# Altium project shkabara_motherboard.PrjPcb
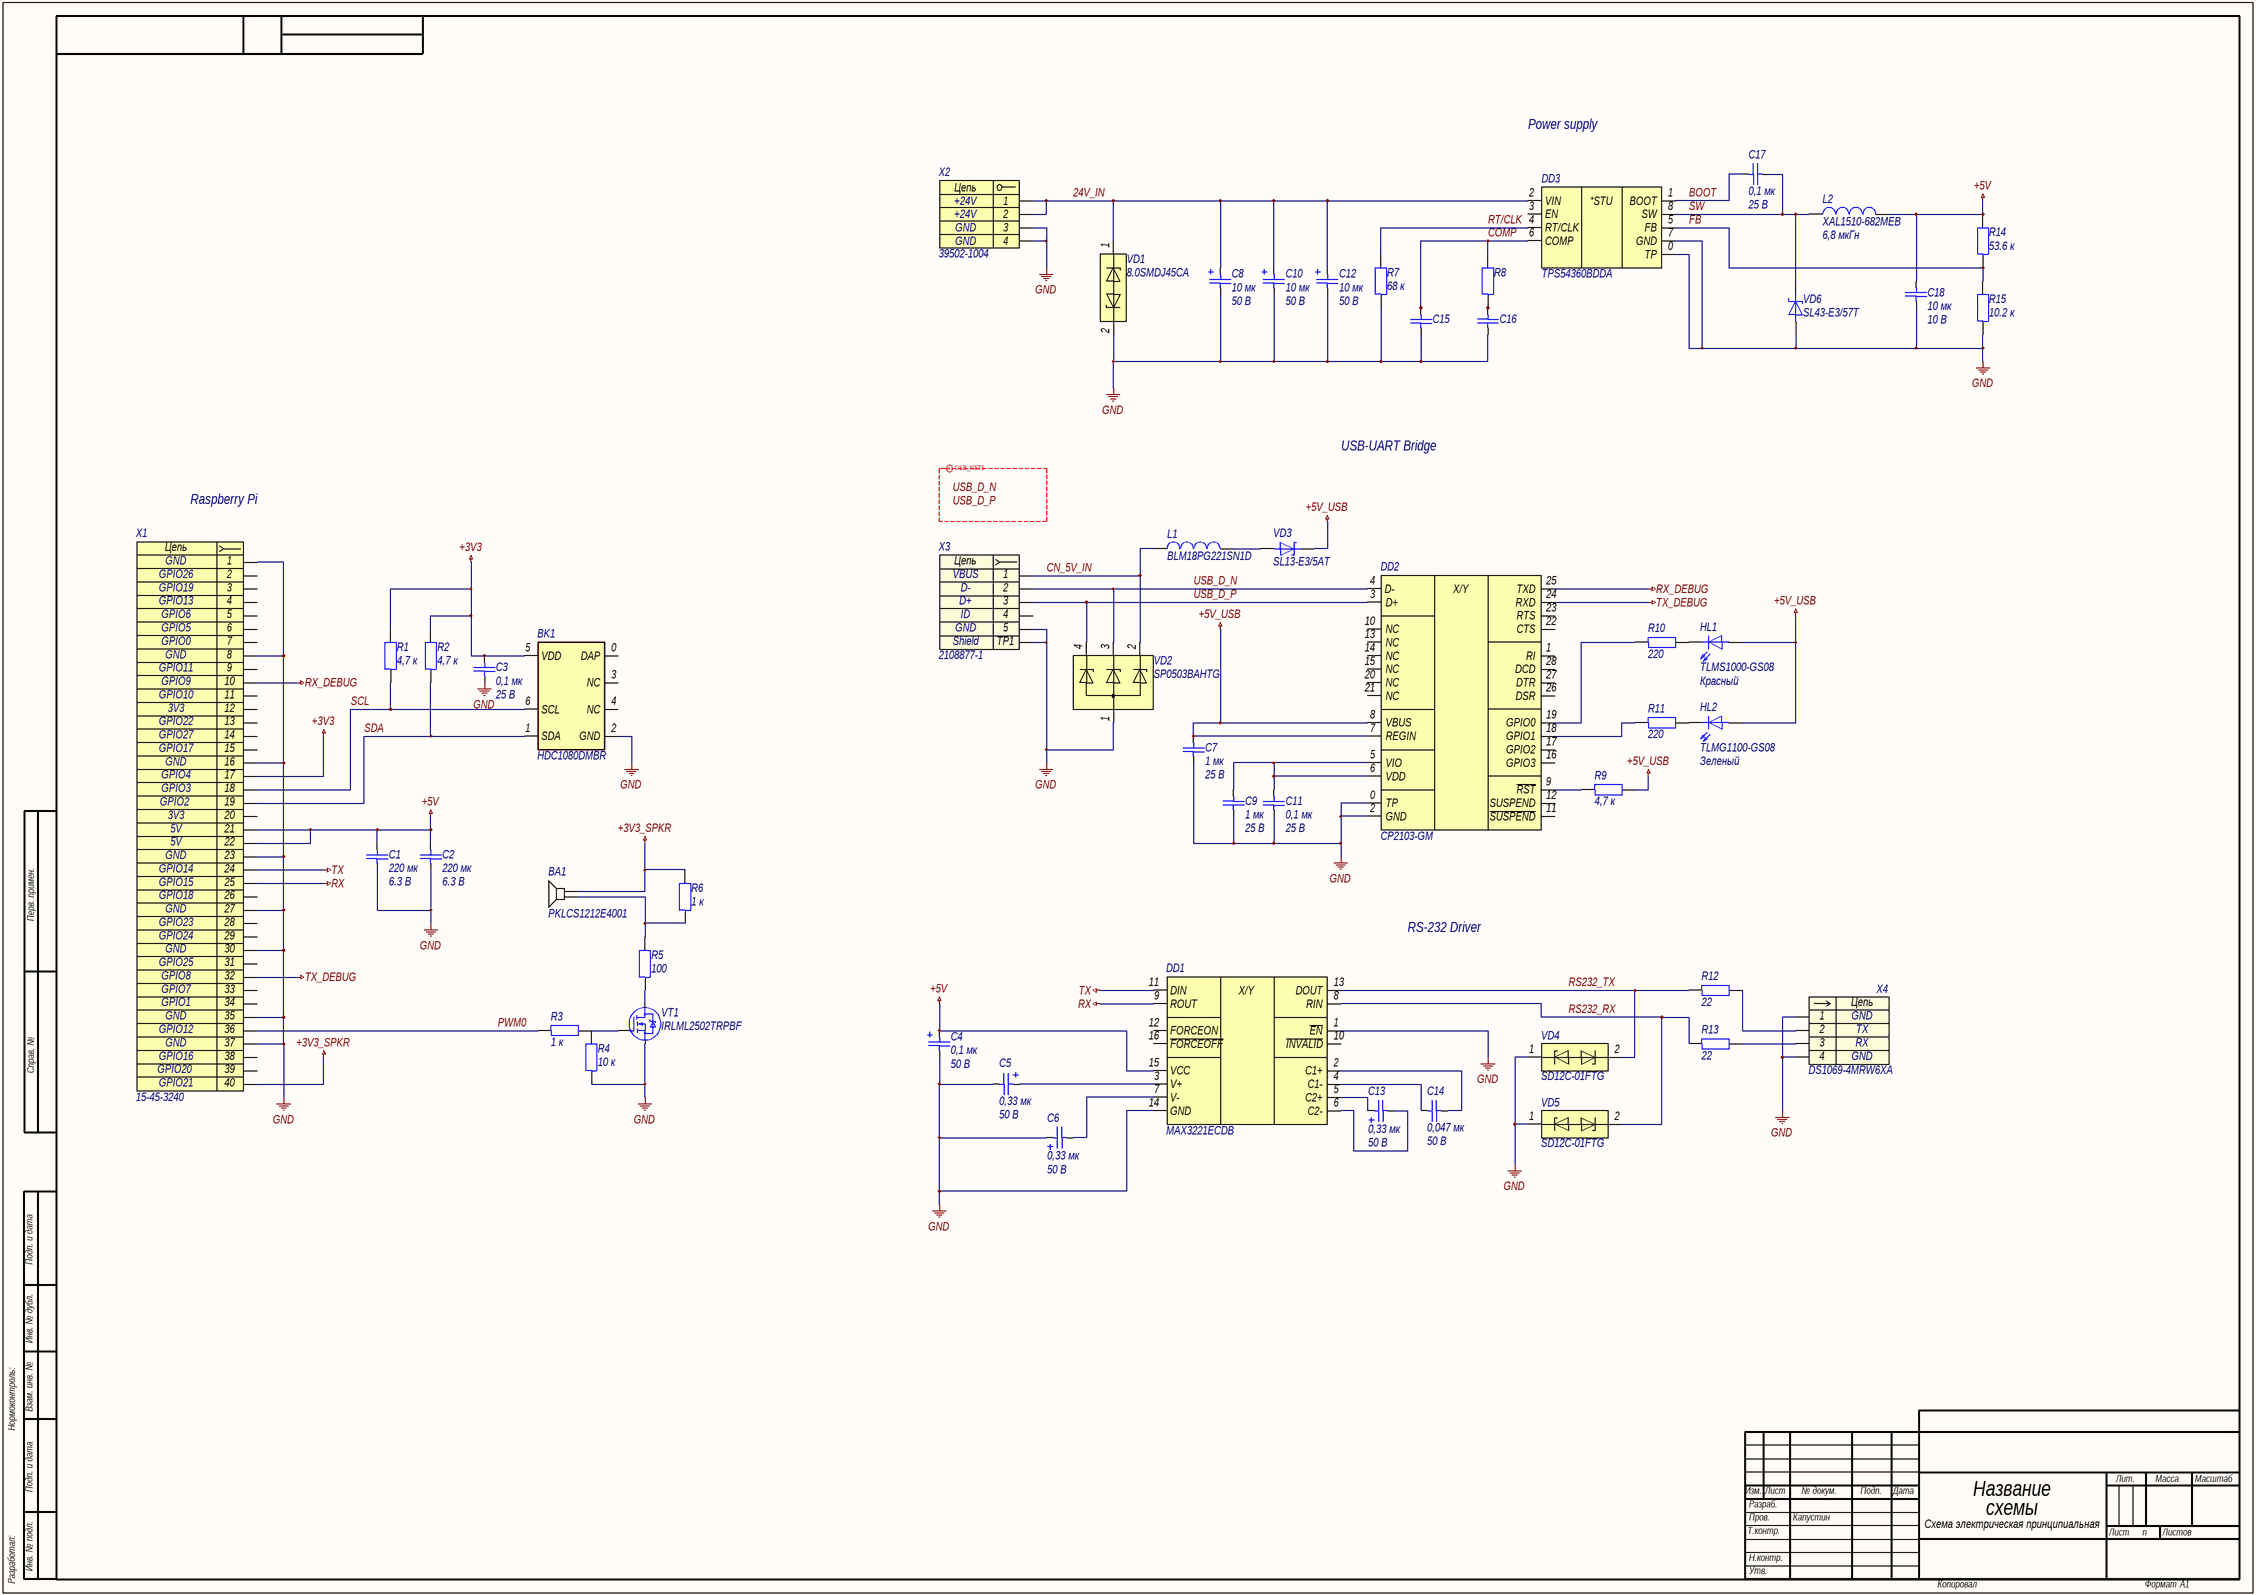
[diagram p0: shkabara_motherboard.SchDoc]
approver: Капустин; check: Капустин; designation: СПБПУ.3331506.026; developer: Шкабара; document_code: Ý3; document_type: Схема электрическая принципиальная; pcb_dec_number: СПБПУ.3331506.026; project: Введите название проекта; sheets_total: 1; title: Введите полное название схемы; title_line_1: Название; title_line_2: схемы
1 sheet, 53 parts. Net scope: global (net labels, ports and power ports of the same name join across sheets).
Board file: shkabara_motherboard.PcbDoc

## Sheet shkabara_motherboard.SchDoc: Введите полное название схемы
size 840 x 594 mm; ApprovedBy: Капустин; CheckedBy: Капустин; DrawnBy: Шкабара; DocumentNumber: СПБПУ.3331506.026Ý3; SheetNumber: n; SheetTotal: 1; DocumentCode: Ý3; ImagePath: СПБПУ.3331506.026

### Parts
BA1  PKLCS1212E4001  [PKLCS1212E4001]
BK1  HDC1080DMBR  [PSON100P300X80_HS-7N]
C1  220 мк  Напряжение: 6.3 В  [C1210]
C2  220 мк  Напряжение: 6.3 В  [C1210]
C3  0,1 мк  Напряжение: 25 В  [C0402]
C4  0,1 мк  Напряжение: 50 В  [C3216-18]
C5  0,33 мк  Напряжение: 50 В  [C3528-21]
C6  0,33 мк  Напряжение: 50 В  [C3528-21]
C7  1 мк  Напряжение: 25 В  [C0603]
C8  10 мк  Напряжение: 50 В  [C7343-43]
C9  1 мк  Напряжение: 25 В  [C0603]
C10  10 мк  Напряжение: 50 В  [C7343-43]
C11  0,1 мк  Напряжение: 25 В  [C0603]
C12  10 мк  Напряжение: 50 В  [C7343-43]
C13  0,33 мк  Напряжение: 50 В  [C3528-21]
C14  0,047 мк  Напряжение: 50 В  [C0603]
C15  1000  [C0603]  (value not drawn)
C16  0,01 мк  [C0603]  (value not drawn)
C17  0,1 мк  Напряжение: 25 В  [C0402]
C18  10 мк  Напряжение: 10 В  [C0805]
DD1  MAX3221ECDB  [SSOP-16-P65-620X530X200-L75X30]
DD2  CP2103-GM  [QFN-28-P50-500X500X100-L55X25-T315X315]
DD3  TPS54360BDDA  [HSOIC-8-P127-490X390X170-L84X41-T310X240]
HL1  TLMS1000-GS08  Цвет: Красный  [HL0603]
HL2  TLMG1100-GS08  Цвет: Зеленый  [HL0603]
L1  BLM18PG221SN1D  [BLM-2-0603]
L2  XAL1510-682MEB  Индуктивность: 6,8 мкГн  [XAL-2-1620X1520X1000]
R1  4,7 к  [R0603]
R2  4,7 к  [R0603]
R3  1 к  [R0603]
R4  10 к  [R0603]
R5  100  [R0603]
R6  1 к  [R0603]
R7  68 к  [R0603]
R8  3,3 к  [R0603]  (value not drawn)
R9  4,7 к  [R0603]
R10  220  [R0603]
R11  220  [R0603]
R12  22  [R0603]
R13  22  [R0603]
R14  53.6 к  [R1218]
R15  10.2 к  [R1218]
VD1  8.0SMDJ45CA  [DO-214AB-790X590X262]
VD2  SP0503BAHTG  [SOT-143-4-P190-292X237X122]
VD3  SL13-E3/5AT  [DO-214AC-510X270X229]
VD4  SD12C-01FTG  [SOD-323-257X130X114]
VD5  SD12C-01FTG  [SOD-323-257X130X114]
VD6  SL43-E3/57T  [DO-214AB-790X590X262]
VT1  IRLML2502TRPBF  [SOT-23-3-P95-292X237X112]
X1  15-45-3240  [15-45-3240]
X2  39502-1004  [39502-1004]
X3  2108877-1  [2108877-1]
X4  DS1069-4MRW6XA  [DS1069-4MRW6XA]

### Nets
+3V3: BK1.5(VDD) C3.1 R1.2 R2.2 X1.17
+3V3_SPKR: BA1.2 R6.2 X1.40
+5V: C1.1 C2.1 C4.1 C18.1 DD1.15(VCC) L2.2 R14.2 X1.21 X1.22
+5V_USB: C7.1 DD2.7(REGIN) DD2.8(VBUS) HL1.2 HL2.2 R9.2 VD3.1
GND: BK1.2(GND) C1.2 C2.2 C3.2 C4.2 C5.2 C6.1 C7.2 C8.2 C9.1 C10.2 C11.2 C12.2 C15.2 C16.1 C18.2 DD1.1(~{EN}) DD1.14(GND) DD2.0(TP) DD2.2(GND) DD3.0(TP) DD3.7(GND) R4.1 R7.1 R15.1 VD1.2 VD2.1 VD4.1 VD5.1 VD6.2 VT1.S X1.1 X1.8 X1.16 X1.23 X1.27 X1.30 X1.35 X1.37 X2.3 X2.4 X3.5 X3.TP1 X4.1 X4.4
RX: DD1.9(ROUT) X1.25
RX_DEBUG: DD2.25(TXD) X1.10
TX: DD1.11(DIN) X1.24
TX_DEBUG: DD2.24(RXD) X1.32
24V_IN: C8.1 C10.1 C12.1 DD3.2(VIN) VD1.1 X2.1 X2.2
BOOT: C17.2 DD3.1(BOOT)
CN_5V_IN: L1.1 VD2.2 X3.1
COMP: C15.1 DD3.6(COMP) R8.2
FB: DD3.5(FB) R14.1 R15.2
PWM0: R3.1 X1.36
RS232_RX: DD1.8(RIN) R13.1 VD5.2
RS232_TX: DD1.13(DOUT) R12.1 VD4.2
RT/CLK: DD3.4(RT/CLK) R7.2
SCL: BK1.6(SCL) R1.1 X1.18
SDA: BK1.1(SDA) R2.1 X1.19
SW: C17.1 DD3.8(SW) L2.1 VD6.1
USB_D_N: DD2.4(D-) VD2.3 X3.2
USB_D_P: DD2.3(D+) VD2.4 X3.3
NetBA1_1: BA1.1 R5.2 R6.1
NetC5_1: C5.1 DD1.3(V+)
NetC6_2: C6.2 DD1.7(V-)
NetC9_2: C9.2 C11.1 DD2.5(VIO) DD2.6(VDD)
NetC13_1: C13.1 DD1.5(C2+)
NetC13_2: C13.2 DD1.6(C2-)
NetC14_1: C14.1 DD1.4(C1-)
NetC14_2: C14.2 DD1.2(C1+)
NetC16_2: C16.2 R8.1
NetDD2_9: DD2.9(~{RST}) R9.1
NetDD2_18: DD2.18(GPIO1) R11.1
NetDD2_19: DD2.19(GPIO0) R10.1
NetHL1_1: HL1.1 R10.2
NetHL2_1: HL2.1 R11.2
NetL1_2: L1.2 VD3.2
NetR3_2: R3.2 R4.2 VT1.G
NetR5_1: R5.1 VT1.D
NetR12_2: R12.2 X4.2
NetR13_2: R13.2 X4.3

Not connected (* = marked no-connect by the designer): BK1 0(DAP) 3(NC) 4(NC); DD1 10(~{INVALID}) 12(FORCEON) 16(~{FORCEOFF}); DD2 1(RI) 10(NC) 11(~{SUSPEND}) 12(SUSPEND) 13(NC) 14(NC) 15(NC) 16(GPIO3) 17(GPIO2) 20(NC) 21(NC) 22(CTS) 23(RTS) 26(DSR) 27(DTR) 28(DCD); DD3 3(EN); X1 2 3 4 5 6 7 9 11 12 13 14 15 20 26 28 29 31 33 34 38 39; X3 4

### Layout directives
differential pair; rule Differential Pairs Routing [Pref Gap = 0.254mm    Min Gap  = 0.15mm    Max Gap  = 0.254mmPref Width = 0.381mm    Min Width  = 0.155mm    Max Width  = 0.381mm]; differential pair class USB_SIGNALS: USB_D_N, USB_D_P

### Notes on the sheet
- Power supply
- USB-UART Bridge
- Raspberry Pi
- RS-232 Driver
- Labels drawn without touching a wire or pin: USB_D_N, USB_D_P
- Перв. примен.
- Справ. №
- Подп. и дата
- Инв. № дубл.
- Нормоконтроль:
- Взам. инв. №
- Изм.
- Лист
- № докум.
- Подп.
- Дата
- Лит.
- Масса
- Масштаб
- Т.контр.
- Пров.
- Разраб.
- Листов
- Разработал:
- Инв. № подл.
- Н.контр.
- Утв.
- Копировал
- Формат
- А1
- (in symbol dd0004) X/Y
- (in symbol dd0006) *STU
- (in symbol dd0015) X/Y
- (in symbol x0001) Цепь
- (in symbol x0043) Цепь
- (in symbol x0049) Цепь
- (in symbol x0054) Цепь

### Library data of the parts
BA1 = PKLCS1212E4001: Piezoelectric Sounders External Drive SMD Type; URL: http://www.farnell.com/datasheets/2157985.pdf
BK1 = HDC1080: HDC1080 Low Power, High Accuracy Digital Humidity Sensor with Temperature Sensor; URL: https://www.ti.com/lit/ds/symlink/hdc1080.pdf?ts=1618660538685
C1 C2 = c0158: =Описание; ID: c0158; Фамилия: Шкабара; Описание: Конденсатор керамический чип 1210 220 мкФ 6.3 В ±10 %; Наименование: CC1210KRX5R5BB227; Производитель: YAGEO Corp.; Отклонение: ±10 %; Рабочие температуры: от –55 °С до +85 °С; Температурный коэффициент емкости: X5R; Корпус: 1210; Номинал: 220 мк; Номинальное напряжение: 6.3 В; HelpURL: https://www.yageo.com/upload/media/product/productsearch/datasheet/mlcc/UPY-GPHC_X5R_4V-to-50V_26.pdf
C3 C17 = c0062: =Описание; ID: c0062; Фамилия: Паньков; Описание: Конденсатор керамический чип 0402 100 нФ 25 В ±10 %; Наименование: CC0402KRX5R8BB104; Производитель: YAGEO Corp.; Отклонение: ±10 %; Рабочие температуры: от –55 °С до +85 °С; Температурный коэффициент емкости: X5R; Корпус: 0402; Номинал: 0,1 мк; Номинальное напряжение: 25 В; HelpURL: https://www.yageo.com/upload/media/product/productsearch/datasheet/mlcc/UPY-GPHC_X5R_4V-to-50V_26.pdf
C4 = c0001: =Описание; ID: c0001; Фамилия: Ларионов; Описание: Конденсатор танталовый чип 3216-18 100 нФ 50 В ±10 %; Наименование: 293D104X9050A2TE3; Производитель: Vishay Intertechnology, Inc.; Отклонение: ±10 %; Эквивалентное последовательное сопротивление: 19,0 Ом; Среднеквадратичный размах пульсации тока: 0,06 А; Рабочие температуры: от –55 °С до +125 °С; Корпус: 3216-18; Номинал: 0,1 мк; Номинальное напряжение: 50 В; HelpURL: https://www.vishay.com/capacitors/list/product-40002/
C5 C6 C13 = c0005: =Описание; ID: c0005; Фамилия: Паньков; Описание: Конденсатор танталовый чип 3528-21 330 нФ 50 В ±10 %; Наименование: 293D334X9050B2TE3; Производитель: Vishay Intertechnology, Inc.; Отклонение: ±10 %; Эквивалентное последовательное сопротивление: 10,0 Ом; Среднеквадратичный размах пульсации тока: 0,09 А; Рабочие температуры: от –55 °С до +125 °С; Корпус: 3528-21; Номинал: 0,33 мк; Номинальное напряжение: 50 В; HelpURL: https://www.vishay.com/capacitors/list/product-40002/
C7 C9 = c0095: =Описание; ID: c0095; Фамилия: Ларионов; Описание: Конденсатор керамический чип 0603 1 мкФ 25 В ±10 %; Наименование: CC0603KRX7R8BB105; Производитель: YAGEO Corp.; Отклонение: ±10 %; Рабочие температуры: от –55 °С до +125 °С; Температурный коэффициент емкости: X7R; Корпус: 0603; Номинал: 1 мк; Номинальное напряжение: 25 В; HelpURL: https://www.yageo.com/upload/media/product/productsearch/datasheet/mlcc/UPY-GPHC_X7R_6.3V-to-50V_20.pdf
C8 C10 C12 = c0082: =Описание; ID: c0082; Фамилия: Паньков; Описание: Конденсатор танталовый чип 7343-43 10 мкФ 50 В ±10 %; Наименование: 293D106X9050E2TE3; Производитель: Vishay Intertechnology, Inc.; Отклонение: ±10 %; Эквивалентное последовательное сопротивление: 0,8 Ом; Среднеквадратичный размах пульсации тока: 0,45 А; Рабочие температуры: от –55 °С до +125 °С; Корпус: 7343-43; Номинал: 10 мк; Номинальное напряжение: 50 В; HelpURL: https://www.vishay.com/capacitors/list/product-40002/
C11 = c0063: =Описание; ID: c0063; Фамилия: Паньков; Описание: Конденсатор керамический чип 0603 100 нФ 25 В ±10 %; Наименование: CC0603KRX7R8BB104; Производитель: YAGEO Corp.; Отклонение: ±10 %; Рабочие температуры: от –55 °С до +125 °С; Температурный коэффициент емкости: X7R; Корпус: 0603; Номинал: 0,1 мк; Номинальное напряжение: 25 В; HelpURL: https://www.yageo.com/upload/media/product/productsearch/datasheet/mlcc/UPY-GPHC_X7R_6.3V-to-50V_20.pdf
C14 = c0055: =Описание; ID: c0055; Фамилия: Паньков; Описание: Конденсатор керамический чип 0603 47 нФ 50 В ±10 %; Наименование: CC0603KRX7R9BB473; Производитель: YAGEO Corp.; Отклонение: ±10 %; Рабочие температуры: от –55 °С до +125 °С; Температурный коэффициент емкости: X7R; Корпус: 0603; Номинал: 0,047 мк; Номинальное напряжение: 50 В; HelpURL: https://www.yageo.com/upload/media/product/productsearch/datasheet/mlcc/UPY-GPHC_X7R_6.3V-to-50V_20.pdf
C15 = c0020: =Описание; Напряжение: 50 В; ID: c0020; Фамилия: Паньков; Описание: Конденсатор керамический чип 0603 1 нФ 50 В ±10 %; Наименование: CC0603KRX7R9BB102; Производитель: YAGEO Corp.; Отклонение: ±10 %; Рабочие температуры: от –55 °С до +125 °С; Температурный коэффициент емкости: X7R; Корпус: 0603; Номинал: 1000; Номинальное напряжение: 50 В; HelpURL: https://www.yageo.com/upload/media/product/productsearch/datasheet/mlcc/UPY-GPHC_X7R_6.3V-to-50V_20.pdf
C16 = c0040: =Описание; Напряжение: 50 В; ID: c0040; Фамилия: Паньков; Описание: Конденсатор керамический чип 0603 10 нФ 50 В ±10 %; Наименование: CC0603KRX7R9BB103; Производитель: YAGEO Corp.; Отклонение: ±10 %; Рабочие температуры: от –55 °С до +125 °С; Температурный коэффициент емкости: X7R; Корпус: 0603; Номинал: 0,01 мк; Номинальное напряжение: 50 В; HelpURL: https://www.yageo.com/upload/media/product/productsearch/datasheet/mlcc/UPY-GPHC_X7R_6.3V-to-50V_20.pdf
C18 = c0124: =Описание; ID: c0124; Фамилия: Паньков; Описание: Конденсатор керамический чип 0805 10 мкФ 10 В ±10 %; Наименование: CC0805KKX7R6BB106; Производитель: YAGEO Corp.; Отклонение: ±10 %; Рабочие температуры: от –55 °С до +125 °С; Температурный коэффициент емкости: X7R; Корпус: 0805; Номинал: 10 мк; Номинальное напряжение: 10 В; HelpURL: https://www.yageo.com/upload/media/product/productsearch/datasheet/mlcc/UPY-GPHC_X7R_6.3V-to-50V_20.pdf
DD1 = dd0015: =Описание; ID: dd0015; Фамилия: Шкабара; Описание: Приемопередатчик RS-232; Производитель: Texas Instruments Inc.; Рабочие температуры: от 0 до +70 °C; Корпус: SSOP-16; Наименование: MAX3221ECDB; HelpURL: https://www.ti.com/product/MAX3221E
DD2 = dd0004: =Описание; ID: dd0004; Фамилия: Кондрашова; Описание: Преобразователь USB-UART; Производитель: Silicon Laboratories; Рабочие температуры: от –40 до +85 °C; Корпус: QFN-28; Наименование: CP2103-GM; HelpURL: https://www.silabs.com/interface/usb-bridges/classic/device.cp2103
DD3 = dd0006: =Описание; ID: dd0006; Фамилия: Жернаков; Описание: Понижающий преобразователь напряжения 4,5…60 В / 1…58,8 В и 3,5 А; Производитель: Texas Instruments Inc.; Входное напряжение: от 4,5 В до 60 В; Выходное напряжение: от 1,0 В до 58,8 В; Коммутируемый ток: до 3,5 А; Частота переключения: от 100 кГц до 2,5 МГц; Рабочие температуры: от –40 °С до +150 °С; Корпус: HSOIC-8; Наименование: TPS54360BDDA; HelpURL: https://www.ti.com/product/TPS54360B
HL1 = hl0001: =Описание; ID: hl0001; Фамилия: Ларионов; Описание: Светодиод чип 0603 красный; Производитель: Vishay Intertechnology, Inc.; Номинальная сила света: 4 мкд; Номинальная длина волны: 628 нм; Номинальный прямой ток: 15 мА; Номинальное падение напряжения: 1,8 В; Рассеиваемая мощность: 40 мВт; Рабочие температуры: от –40 °С до +100 °С; Корпус: 0603; Наименование: TLMS1000-GS08; HelpURL: https://www.vishay.com/leds/list/product-83172/
HL2 = hl0005: =Описание; ID: hl0005; Фамилия: Ларионов; Описание: Светодиод чип 0603 зеленый; Производитель: Vishay Intertechnology, Inc.; Номинальная сила света: 35 мкд; Номинальная длина волны: 570 нм; Номинальный прямой ток: 30 мА; Номинальное падение напряжения: 2,1 В; Рассеиваемая мощность: 90 мВт; Рабочие температуры: от –40 °С до +100 °С; Корпус: 0603; Наименование: TLMG1100-GS08; HelpURL: https://www.vishay.com/leds/list/product-83173/
L1 = l0002: =Описание; ID: l0002; Фамилия: Самарин; Описание: Ферритовая бусина 220 Ом ±25 %; Производитель: Murata Manufacturing Co., Ltd.; Сопротивление, 100 МГц: 220 Ом; Отклонение, 100 МГц: ±25 %; Сопротивление при постоянном токе: 0,1 Ом; Рабочие температуры: от –55 °С до +125 °С; Корпус: 0603; Наименование: BLM18PG221SN1D; HelpURL: https://www.murata.com/en-global/products/productdetail?partno=BLM18PG221SN1%23
L2 = l0003: =Описание; ID: l0003; Фамилия: Засецкий; Описание: Катушка индуктивности 6,8 мкГн ±20 %; Производитель: Coilcraft, Inc.; Отклонение: ±20 %; Номинальное активное сопротивление: 4,17 мОм; Максимальное активное сопротивление: 4,6 мОм; Резонансная частота: 11,5 МГц; Номинальный ток (при нагреве на 20 °С/40 °С): 19 А; Ток насыщения: 36 А; Рабочее напряжение: от 0 В до 60 В; Рабочие температуры: от –40 °С до +125 °С; Корпус: 16,2 x 15,2 x 10; Наименование: XAL1510-682MEB; Номинал: 6,8 мкГн; HelpURL: https://www.coilcraft.com/en-us/products/power/shielded-inductors/molded-inductor/xal/xal1510
R1 R2 R9 = r0094: =Описание; ID: r0094; Фамилия: Ларионов; Описание: Резистор чип 0603 4,7 кОм ±1 % 0,1 Вт; Наименование: RC0603FR-074K7L; Производитель: YAGEO Corp.; Отклонение: ±1 %; Номинальное напряжение: 75 В; Номинальный ток: 1 А; Рабочие температуры: от –55 °С до +155 °С; Корпус: 0603; Примечание: Ряд E24; Номинал: 4,7 к; HelpURL: https://www.yageo.com/upload/media/product/productsearch/datasheet/rchip/PYu-RC_Group_51_RoHS_L_11.pdf
R3 R6 = r0076: =Описание; ID: r0076; Фамилия: Ларионов; Описание: Резистор чип 0603 1 кОм ±1 % 0,1 Вт; Наименование: RC0603FR-071KL; Производитель: YAGEO Corp.; Отклонение: ±1 %; Номинальное напряжение: 75 В; Номинальный ток: 1 А; Рабочие температуры: от –55 °С до +155 °С; Корпус: 0603; Примечание: Ряд E24; Номинал: 1 к; HelpURL: https://www.yageo.com/upload/media/product/productsearch/datasheet/rchip/PYu-RC_Group_51_RoHS_L_11.pdf
R4 = r0105: =Описание; ID: r0105; Фамилия: Самарин; Описание: Резистор чип 0603 10 кОм ±1 % 0,1 Вт; Наименование: RC0603FR-0710KL; Производитель: YAGEO Corp.; Отклонение: ±1 %; Номинальное напряжение: 75 В; Номинальный ток: 1 А; Рабочие температуры: от –55 °С до +155 °С; Корпус: 0603; Примечание: Ряд E24; Номинал: 10 к; HelpURL: https://www.yageo.com/upload/media/product/productsearch/datasheet/rchip/PYu-RC_Group_51_RoHS_L_11.pdf
R5 = r0052: =Описание; ID: r0052; Фамилия: Самарин; Описание: Резистор чип 0603 100 Ом ±1 % 0,1 Вт; Наименование: RC0603FR‍‐07100RL; Производитель: YAGEO Corp.; Отклонение: ±1 %; Номинальное напряжение: 75 В; Номинальный ток: 1 А; Рабочие температуры: от –55 °С до +155 °С; Корпус: 0603; Примечание: Ряд E24; Номинал: 100; HelpURL: https://www.yageo.com/upload/media/product/productsearch/datasheet/rchip/PYu-RC_Group_51_RoHS_L_11.pdf
R7 = r0136: =Описание; ID: r0136; Фамилия: Паньков; Описание: Резистор чип 0603 68 кОм ±1 % 0,1 Вт; Наименование: RC0603FR-0768KL; Производитель: YAGEO Corp.; Отклонение: ±1 %; Номинальное напряжение: 75 В; Номинальный ток: 1 А; Рабочие температуры: от –55 °С до +155 °С; Корпус: 0603; Примечание: Ряд E24; Номинал: 68 к; HelpURL: https://www.yageo.com/upload/media/product/productsearch/datasheet/rchip/PYu-RC_Group_51_RoHS_L_11.pdf
R8 = r0089: =Описание; ID: r0089; Фамилия: Паньков; Описание: Резистор чип 0603 3,3 кОм ±1 % 0,1 Вт; Наименование: RC0603FR-073K3L; Производитель: YAGEO Corp.; Отклонение: ±1 %; Номинальное напряжение: 75 В; Номинальный ток: 1 А; Рабочие температуры: от –55 °С до +155 °С; Корпус: 0603; Примечание: Ряд E24; Номинал: 3,3 к; HelpURL: https://www.yageo.com/upload/media/product/productsearch/datasheet/rchip/PYu-RC_Group_51_RoHS_L_11.pdf
R10 R11 = r0060: =Описание; ID: r0060; Фамилия: Ларионов; Описание: Резистор чип 0603 220 Ом ±1 % 0,1 Вт; Наименование: RC0603FR-07220RL; Производитель: YAGEO Corp.; Отклонение: ±1 %; Номинальное напряжение: 75 В; Номинальный ток: 1 А; Рабочие температуры: от –55 °С до +155 °С; Корпус: 0603; Примечание: Ряд E24; Номинал: 220; HelpURL: https://www.yageo.com/upload/media/product/productsearch/datasheet/rchip/PYu-RC_Group_51_RoHS_L_11.pdf
R12 R13 = r0034: =Описание; ID: r0034; Фамилия: Ларионов; Описание: Резистор чип 0603 22 Ом ±1 % 0,1 Вт; Наименование: RC0603FR-0722RL; Производитель: YAGEO Corp.; Отклонение: ±1 %; Номинальное напряжение: 75 В; Номинальный ток: 1 А; Рабочие температуры: от –55 °С до +155 °С; Корпус: 0603; Примечание: Ряд E24; Номинал: 22; HelpURL: https://www.yageo.com/upload/media/product/productsearch/datasheet/rchip/PYu-RC_Group_51_RoHS_L_11.pdf
R14 = r0205: =Описание; ID: r0205; Фамилия: Шкабара; Описание: Резистор чип 1218 53.6 кОм ±1 % 1 Вт; Наименование: AA1218FK-0753K6L; Производитель: YAGEO Corp.; Отклонение: ±1 %; Номинальное напряжение: 200 В; Номинальный ток: 6 А; Рабочие температуры: от –55 °С до +155 °С; Корпус: 1218; Примечание: Ряд E96; Номинал: 53.6 к; HelpURL: https://www.yageo.com/upload/media/product/productsearch/datasheet/rchip/PYu-AA_51_RoHS_L_3.pdf
R15 = r0204: =Описание; ID: r0204; Фамилия: Шкабара; Описание: Резистор чип 1218 10.2 кОм ±1 % 1 Вт; Наименование: AA1218FK-0710K2L; Производитель: YAGEO Corp.; Отклонение: ±1 %; Номинальное напряжение: 200 В; Номинальный ток: 6 А; Рабочие температуры: от –55 °С до +155 °С; Корпус: 1218; Примечание: Ряд E96; Номинал: 10.2 к; HelpURL: https://www.yageo.com/upload/media/product/productsearch/datasheet/rchip/PYu-AA_51_RoHS_L_3.pdf
VD1 = vd0008: =Описание; ID: vd0008; Фамилия: Шкабара; Описание: Двунаправленная диодная сборка для подавления помех 45 В; Производитель: Littelfuse, Inc.; Корпус: DO-214AB; Наименование: 8.0SMDJ45CA; HelpURL: https://www.littelfuse.com/products/tvs-diodes/surface-mount/8.0smdj.aspx
VD2 = vd0001: =Описание; ID: vd0001; Фамилия: Ларионов; Описание: Диодная сборка для подавления помех 5 В; Производитель: Littelfuse, Inc.; Корпус: SOT-143-4; Наименование: SP0503BAHTG; HelpURL: https://www.littelfuse.com/products/tvs-diode-arrays/general-purpose-esd-protection/sp050xba-lead-free-green.aspx
VD3 = vd0003: =Описание; ID: vd0003; Фамилия: Ларионов; Описание: Диод Шоттки 30 В 1,5 А; Производитель: Vishay Intertechnology, Inc.; Максимальное прямое напряжение: 0,445 В; Максимальное обратное напряжение: 30 В; Максимальный прямой ток: 1,5 А; Рабочие температуры: от –55 °С до +125 °С; Корпус: DO-214AC; Наименование: SL13-E3/5AT; HelpURL: https://www.vishay.com/product?docid=88740
VD4 VD5 = vd0004: =Описание; ID: vd0004; Фамилия: Ларионов; Описание: Двунаправленная диодная сборка для подавления помех 12 В; Производитель: Littelfuse, Inc.; Корпус: SOD-323; Наименование: SD12C-01FTG; HelpURL: https://www.littelfuse.com/products/tvs-diode-arrays/general-purpose-esd-protection/sdc/sd12c_01ftg.aspx
VD6 = vd0008: =Описание; ID: vd0008; Фамилия: Шкабара; Описание: Диод Шоттки 30 В 4 А; Производитель: Vishay Intertechnology, Inc.; Максимальное прямое напряжение: 0,42 В; Максимальное обратное напряжение: 30 В; Максимальный прямой ток: 4 А; Рабочие температуры: от –55 °С до +150 °С; Корпус: DO-214AB; Наименование: SL43-E3/57T; HelpURL: https://www.vishay.com/diodes/list/product-88742/
VT1 = vt0006: =Описание; ID: vt0006; Фамилия: Паньков; Описание: Полевой N-канальный МДП-транзистор 20 В 4,2 А; Производитель: Infineon Technologies AG; Напряжение затвор — исток: ±12 В; Напряжение сток — исток: 20 В; Ток стока: 4,2 А; Сопротивление сток — исток: 80 мОм; Рабочие температуры: от –55 °С до +150 °С; Корпус: SOT-23-3; Наименование: IRLML2502TRPBF; HelpURL: https://www.infineon.com/cms/en/product/power/mosfet/12v-300v-n-channel-power-mosfet/irlml2502/
X1 = x0054: =Описание; Contact_1: GND; Contact_2: GPIO26; Contact_3: GPIO19; Contact_4: GPIO13; Contact_5: GPIO6; Contact_6: GPIO5; Contact_7: GPIO0; Contact_9: GPIO11; Contact_10: GPIO9; Contact_11: GPIO10; Contact_12: 3V3; Contact_13: GPIO22; Contact_14: GPIO27; Contact_15: GPIO17; Contact_17: GPIO4; Contact_18: GPIO3; Contact_19: GPIO2; Contact_21: 5V; Contact_24: GPIO14; Contact_25: GPIO15; Contact_26: GPIO18; Contact_28: GPIO23; Contact_29: GPIO24; Contact_31: GPIO25; Contact_32: GPIO8; Contact_33: GPIO7; Contact_34: GPIO1; Contact_36: GPIO12; Contact_38: GPIO16; Contact_39: GPIO20; Contact_40: GPIO21; ID: x0054; Фамилия: Козлов; Описание: C-Grid 40 pin 2,54 мм гнездо прямой; Производитель: Molex; Contact_8: GND; Contact_16: GND; Contact_20: 3V3; Contact_22: 5V; Contact_23: GND; Contact_27: GND; Contact_30: GND; Contact_35: GND; Contact_37: GND; Наименование: 15-45-3240; HelpURL: https://www.molex.com/molex/products/part-detail/pcb_receptacles/0015453240
X2 = x0049: =Описание; Contact_1: +24V; Contact_3: GND; ID: x0049; Фамилия: Шкабара; Описание: Terminal Block 4 pin 3,5 мм; Производитель: Molex; Contact_2: +24V; Contact_4: GND; Наименование: 39502-1004; HelpURL: https://www.molex.com/molex/products/part-detail/terminal_blocks/0395021004
X3 = x0001: =Описание; Contact_1: VBUS; Contact_2: D-; Contact_3: D+; Contact_4: ID; Contact_5: GND; TP1: Shield; ID: x0001; Фамилия: Ларионов; Описание: Micro USB 2.0 Type B IP68 гнездо угловой; Производитель: TE Connectivity; Наименование: 2108877-1; HelpURL: https://www.te.com/global-en/product-2108877-1.html
X4 = x0043: =Описание; Contact_1: GND; Contact_2: TX; Contact_3: RX; ID: x0043; Фамилия: Паньков; Описание: CWF 4 pin Type A 2,5 мм вилка угловой; Производитель: Connfly Electronic Co., Ltd.; Contact_4: GND; Наименование: DS1069-4MRW6XA; HelpURL: http://en.connfly.group/product/xVkr=EusQssAN0gN=Aos=mU+UrVkR9kqEAN0gN0MUR+g+NB+A